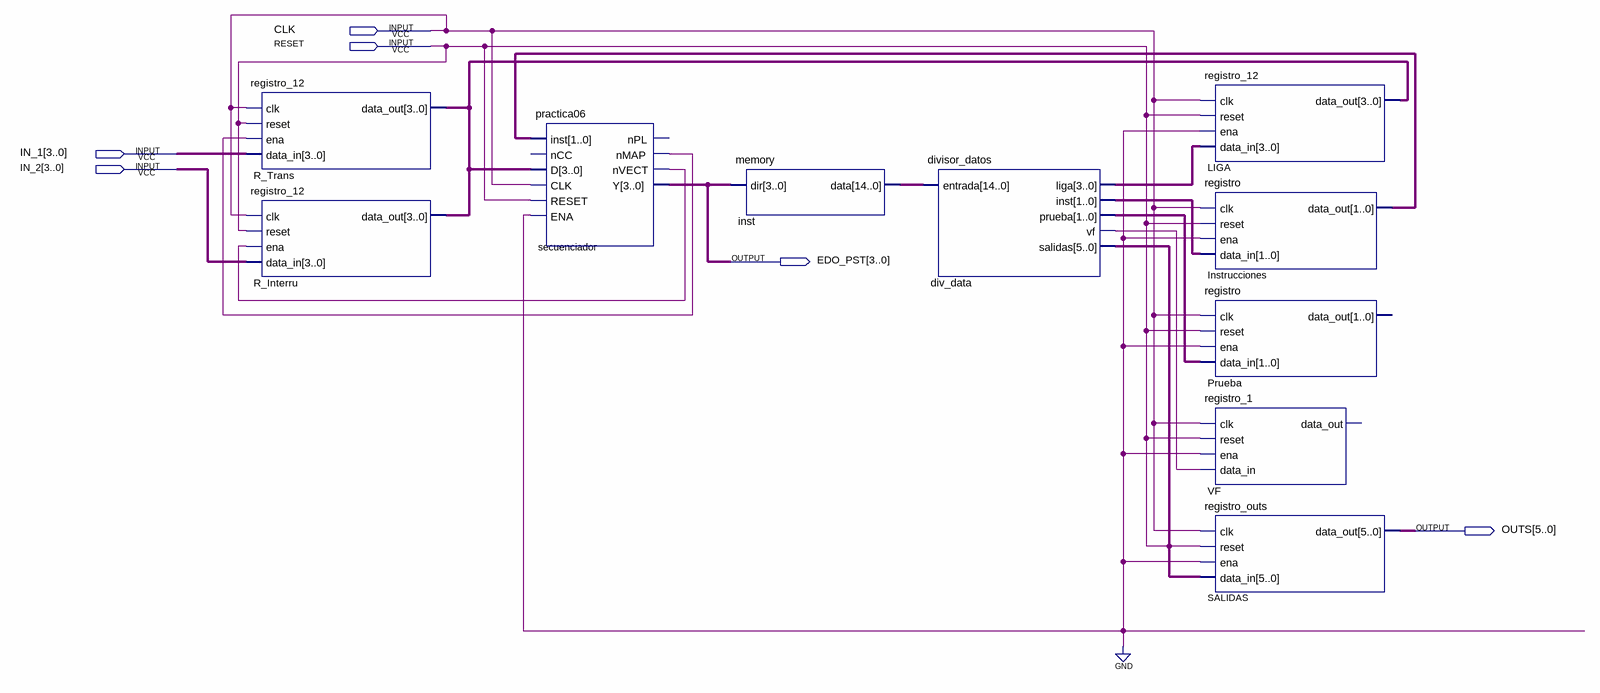
[diagram p0: schematic sheet]
// Quartus schematic implementacion.bdf as structural Verilog: 10 symbols, 6 pins
module implementacion (
  input  CLK,
  input  RESET,
  input  [3:0] IN_1,
  input  [3:0] IN_2,
  output [3:0] EDO_PST,
  output [5:0] OUTS
);

  wire div_data_vf, secuenciador_nmap, secuenciador_nvect;
  wire [1:0] div_data_inst, div_data_prueba, Instrucciones_data_out;
  wire [3:0] div_data_liga, R_Trans_data_out;
  wire [5:0] div_data_salidas;
  wire [14:0] inst_data;

  registro_12 R_Trans (.clk(CLK), .reset(RESET), .ena(secuenciador_nmap), .data_in(IN_1), .data_out(R_Trans_data_out));
  registro_12 R_Interru (
    .clk(CLK), .reset(RESET), .ena(secuenciador_nvect), .data_in(IN_2), .data_out(R_Trans_data_out));
  practica06 secuenciador (
    .inst(Instrucciones_data_out), .D(R_Trans_data_out), .CLK(CLK), .RESET(RESET), .ENA(1'b0),
    .nMAP(secuenciador_nmap), .nVECT(secuenciador_nvect), .Y(EDO_PST));  // open: nCC, nPL
  memory inst (.dir(EDO_PST), .data(inst_data));
  divisor_datos div_data (
    .entrada(inst_data), .liga(div_data_liga), .inst(div_data_inst), .prueba(div_data_prueba),
    .vf(div_data_vf), .salidas(div_data_salidas));
  registro_12 LIGA (.clk(CLK), .reset(RESET), .ena(1'b0), .data_in(div_data_liga), .data_out(R_Trans_data_out));
  registro Instrucciones (
    .clk(CLK), .reset(RESET), .ena(1'b0), .data_in(div_data_inst), .data_out(Instrucciones_data_out));
  registro Prueba (.clk(CLK), .reset(RESET), .ena(1'b0), .data_in(div_data_prueba));  // open: data_out
  registro_1 VF (.clk(CLK), .reset(RESET), .ena(1'b0), .data_in(div_data_vf));  // open: data_out
  registro_outs SALIDAS (.clk(CLK), .reset(RESET), .ena(1'b0), .data_in(div_data_salidas), .data_out(OUTS));
endmodule
